# Altium schematic sheet MotorDriver.SchDoc
size A4; SheetNumber: 4; SheetTotal: 4
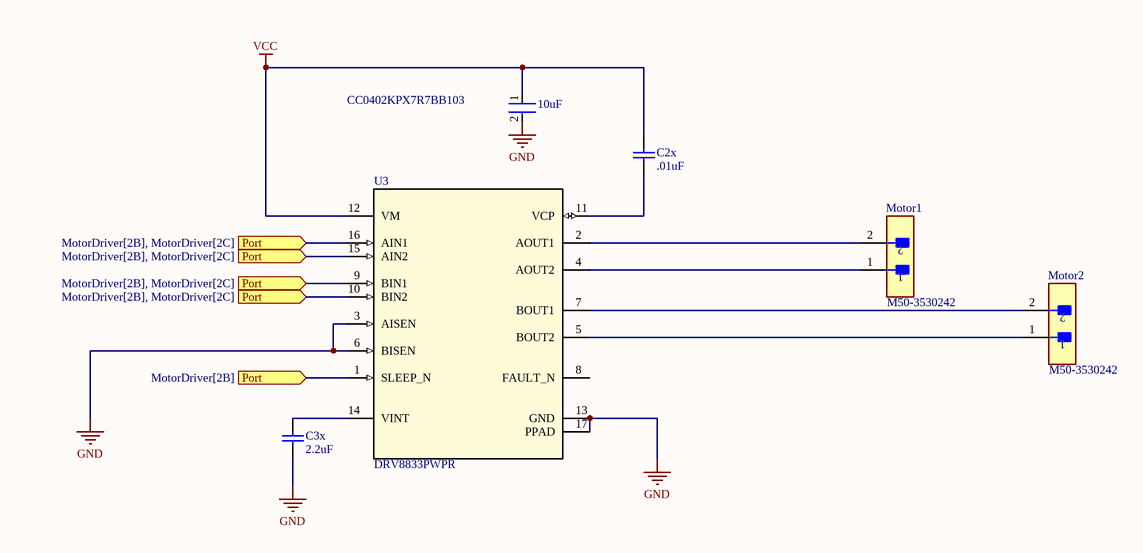
[diagram p0: MotorDriver.SchDoc]

## Parts
10uF  CC0402KPX7R7BB103  [FP-CC0402-MFG]
C2x  value .01uF  (hidden comment: Capacitor)
C3x  value 2.2uF  (hidden comment: Capacitor)
Motor1  M50-3530242  [FP-M50-3530242-MFG]
Motor2  M50-3530242  [FP-M50-3530242-MFG]
U3  DRV8833PWPR  [PWP0016C_N]

## Ports
Port (in, see MotorDriver[2B]), Port (in, see MotorDriver[2B], MotorDriver[2C])

## Nets
GND: 10uF.2 C3x.1 U3.3(AISEN) U3.6(BISEN) U3.13(GND) U3.17(PPAD)
VCC: 10uF.1 C2x.2 U3.12(VM)
Port: U3.1(SLEEP_N) U3.9(BIN1) U3.10(BIN2) U3.15(AIN2) U3.16(AIN1) ; port Port
NetC2x_1: C2x.1 U3.11(VCP)
NetC3x_2: C3x.2 U3.14(VINT)
NetMotor1_1: Motor1.1 U3.4(AOUT2)
NetMotor1_2: Motor1.2 U3.2(AOUT1)
NetMotor2_1: Motor2.1 U3.5(BOUT2)
NetMotor2_2: Motor2.2 U3.7(BOUT1)

Not connected (* = marked no-connect by the designer): U3 8(FAULT_N)

## Library data of the parts
10uF = CMP-03422-000420-1: CC0402 10 nF X7R 10.00% 16 V; Manufacturer: YAGEO; Capacitance: 10 nF; Value: 10 nF; Tolerance: 0.1; Voltage Rating: 16 V; Automotive Grade: NA; Temperature Coefficient: 30ppm/°C; Automotive: No; Device Class L1: Passive Components; Temperature Range Low: -55°C; Ipc Land Pattern Name: CAPC10050X50; Temperature Characteristic: X7R; Lead Free: Yes; Footprint Url: http://www.yageo.com/exep/pages/download/literatures/UPY-C_GEN_24.pdf; Octopart: https://octopart.com/cc0402kpx7r7bb103-yageo-12885102; RoHS: TRUE; Height: 0.55mm; Device Class L3: Ceramic Capacitors; Mouser Description: Multilayer Ceramic Capacitors MLCC - SMD/SMT 10nF 16V X7R 10%; Package: CC0402; ComponentLink2Description: Datasheet; Category: Cap; Material: Ceramic; ComponentLink2URL: http://www.yageo.com/documents/recent/UPY-GP_NP0_16V-to-50V_16.pdf; Temperature: -55°C to +125°C; Manufacturer Part Number: CC0402KPX7R7BB103; Temperature Range High: +125°C; Device Class L2: Capacitors
C2x C3x = Capacitor: SimulationGenericComponent: True
Motor1 Motor2 = CMP-15831-000040-1: CONN HEADER VERT 2POS 1.27MM
U3 = DRV8833PWPR: 10.8-V, 2-A dual H-bridge motor driver with current regulation 16-HTSSOP -40 to 85; Manufacturer_Name: Texas Instruments; TYPE: TYPE; RefDes: RefDes; Copyright: Copyright (C) 2025 Ultra Librarian. All rights reserved.; Manufacturer_Part_Number: DRV8833PWPR